# EAGLE design usbswitch (EAGLE 7.6.0)
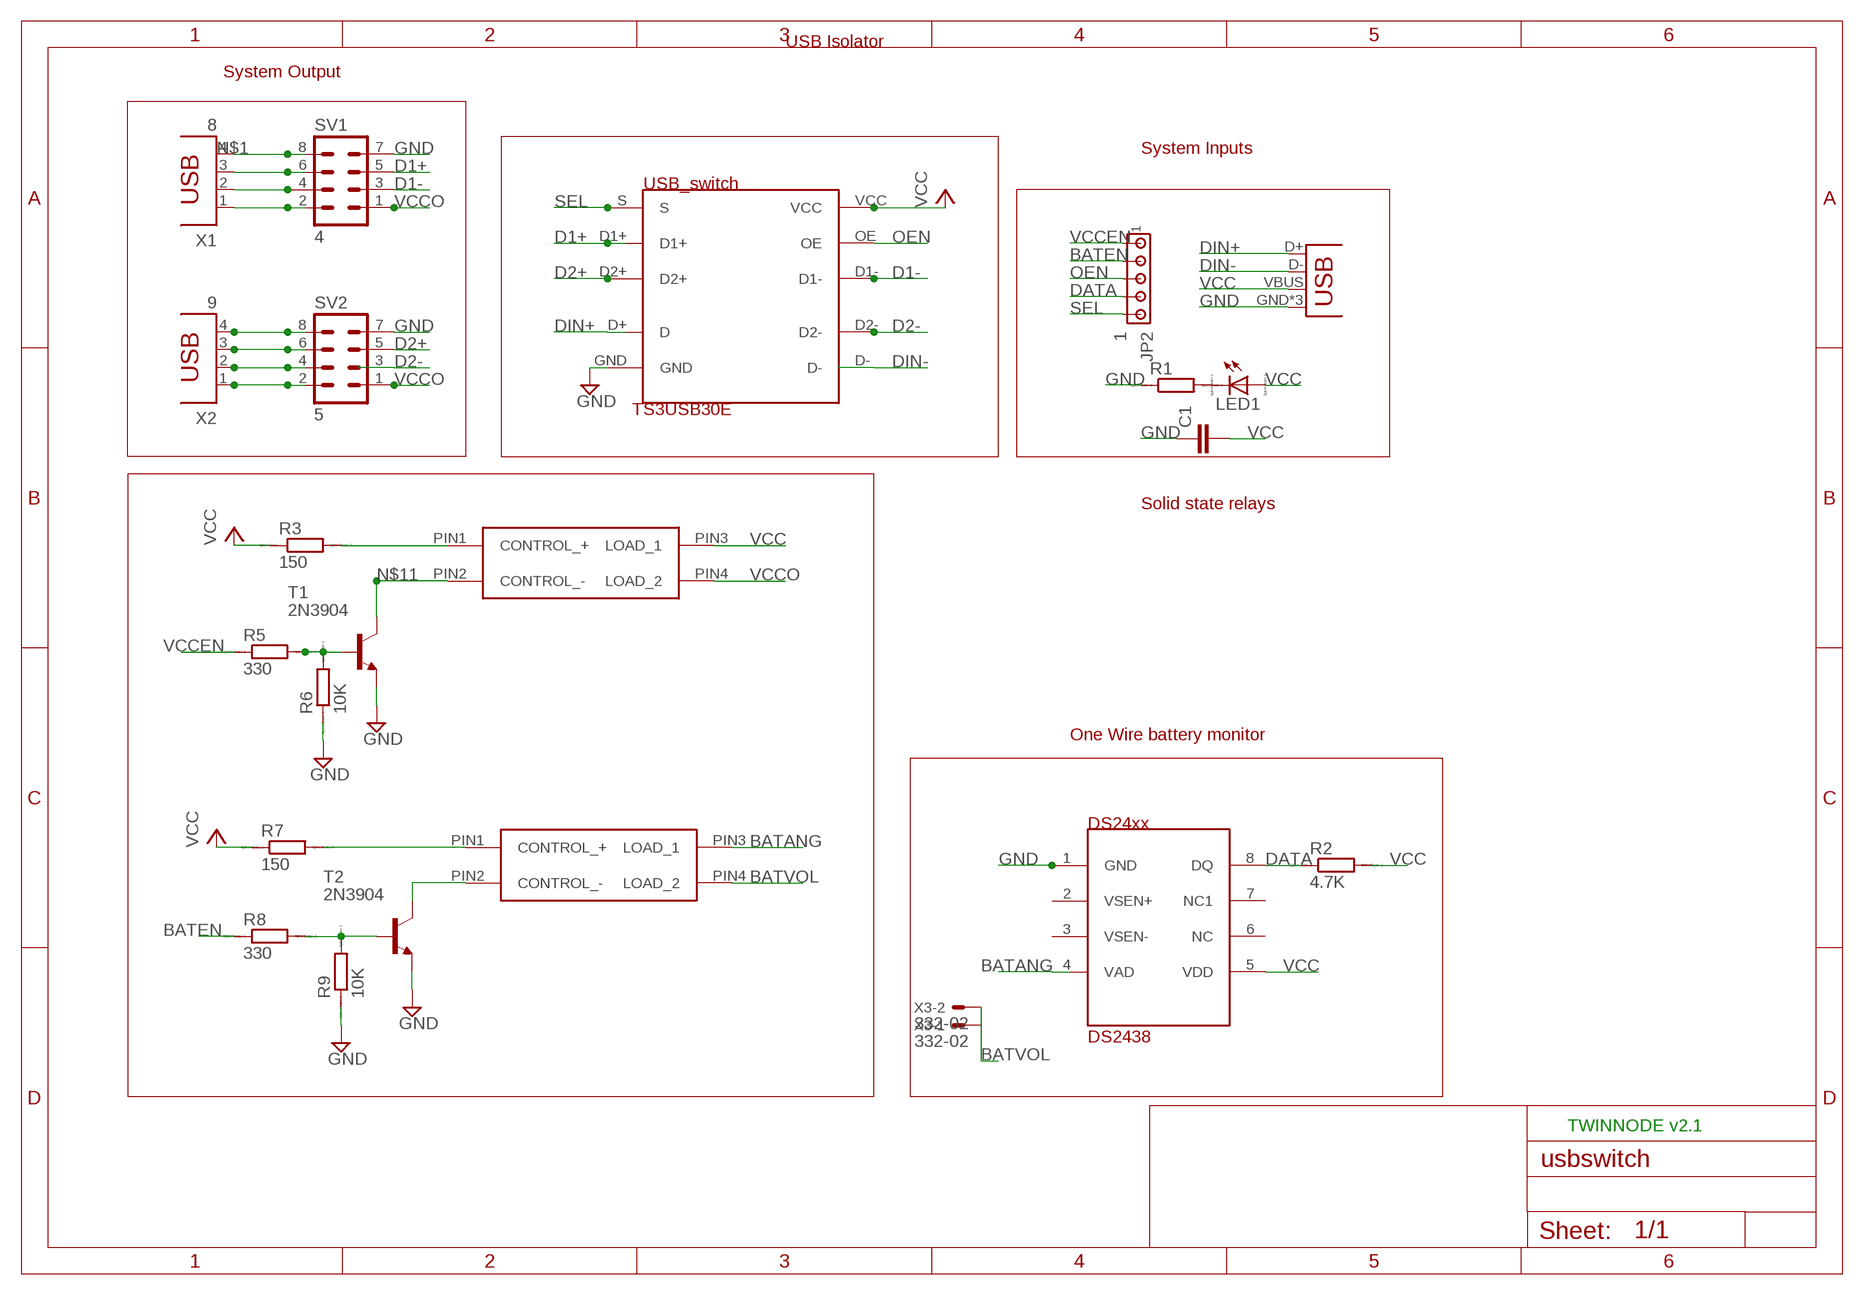
[diagram p0: schematic, sheet 1]

## Parts
C1  C2.5/6  [C2.5-6]
JP1  USB-MICROB  [USB-MICROB]
JP2  1  MTA05-100  [10X05MTA]
LED1  LED_ELD260  [LED_LD260]
R1  RR3216  [R3216]
R2  4.7K  RR3216  [R3216]
R3  150  RR3216  [R3216]
R5  330  RR3216  [R3216]
R6  10K  RR3216  [R3216]
R7  150  RR3216  [R3216]
R8  330  RR3216  [R3216]
R9  10K  RR3216  [R3216]
SV1  4  MA04-2  [MA04-2]
SV2  5  MA04-2  [MA04-2]
T1  2N3904  [TO92]
T2  2N3904  [TO92]
U$1  USB_SWITCH  [PDSO-G10]
U$2  DS2438  [DS243PKG]
U$3  OPTO-RELAY-CPC1017N  [SOP-4]
U$4  OPTO-RELAY-CPC1017N  [SOP-4]
X1  8  PN87520  [PN87520]
X2  9  PN87520  [PN87520]
X3  332-02  [332-02]

## Nets
BATANG: U$2.4(VAD) U$3.PIN3(LOAD_1)
BATEN: JP2.2 R8.1
BATVOL: U$3.PIN4(LOAD_2) X3.1 X3.2
D1+: SV1.5 U$1.D1+
D1-: SV1.3 U$1.D1-
D2+: SV2.5 U$1.D2+
D2-: SV2.3 U$1.D2-
DATA: JP2.4 R2.1 U$2.8(DQ)
DIN+: JP1.D+ U$1.D+(D)
DIN-: JP1.D- U$1.D-
GND: C1.1 JP1.GND JP1.MT1(GND) JP1.MT2(GND) R1.1 R6.1 R9.1 SV1.7 SV2.7 T1.3(E) T2.3(E) U$1.GND U$2.1(GND)
N$1: SV1.8 X1.4
N$2: SV1.6 X1.3
N$3: SV1.4 X1.2
N$4: LED1.K(C) R1.2
N$5: SV2.8 X2.4
N$6: SV2.6 X2.3
N$7: SV2.4 X2.2
N$10: R5.2 R6.2 T1.2(B)
N$11: T1.1(C) U$4.PIN2(CONTROL_-)
N$12: R3.2 U$4.PIN1(CONTROL_+)
N$14: R8.2 R9.2 T2.2(B)
N$16: T2.1(C) U$3.PIN2(CONTROL_-)
N$18: R7.2 U$3.PIN1(CONTROL_+)
N$50: SV1.2 X1.1
N$51: SV2.2 X2.1
OEN: JP2.3 U$1.OE
SEL: JP2.5 U$1.S
VCC: C1.2 JP1.VBUS LED1.A R2.2 R3.1 R7.1 U$1.VCC U$2.5(VDD) U$4.PIN3(LOAD_1)
VCCEN: JP2.1 R5.1
VCCO: SV1.1 SV2.1 U$4.PIN4(LOAD_2)
Unconnected: U$2.2(VSEN+) U$2.3(VSEN-) U$2.6(NC) U$2.7(NC1)

## Notes on the sheet
- USB Isolator
- System Output
- System Inputs
- Solid state relays
- One Wire battery monitor
- TWINNODE v2.1

## Library data of the parts
C1 = capacitor-wima:C: CAPACITOR naming: grid - package width
JP1 = Feesta-parts:USB: USB Connectors USB-B-PTH is fully proven SKU : PRT-00139/CONN-08278 USB-miniB is fully proven SKU : PRT-00587 USB-A-PCB is untested. USB-A-H is throughly reviewed, but untested. Spark Fun Electronics SKU : PRT-00437 USB-B-SMT is throughly reviewed, but untested. Needs silkscreen touching up. USB-A-S has not been used/tested USB-MB-H has not been used/tested USB-MICROB has been used. CONN-09505; PROD_ID: CONN-09505
JP2 = con-amp:MTA05-100: AMP connector
LED1 = eagle-ltspice:LED_E: LED Source: http://www.osram.convergy.de Source: www.luxeon.com Source: www.kingbright.com; SPICEMODEL: NONE; SPICEPREFIX: D; SPICETYPE: diode
R1-R3 R5-R9 = eagle-ltspice:R: RESISTOR, European symbol; SPICEMODEL: NONE; SPICEPREFIX: R
SV1 SV2 = con-lstb:MA04-2: PIN HEADER; OC_FARNELL: unknown; OC_NEWARK: unknown
T1 T2 = transistor:2N3904: NPN TRANSISTOR
U$1 = myusbswitch:USB_SWITCH: Usb_switch
U$2 = DS24xx:DS2438
U$3 U$4 = Feesta-parts:OPTO-RELAY-CPC1017N
X1 X2 = con-berg:PN87520: BERG USB connector; OC_FARNELL: unknown; OC_NEWARK: unknown
X3 = con-garry:332-02: 2 Pin - 2mm Dual Row Source: www.mpe-connector.de / garry_shortform_2012.pdf

## Board
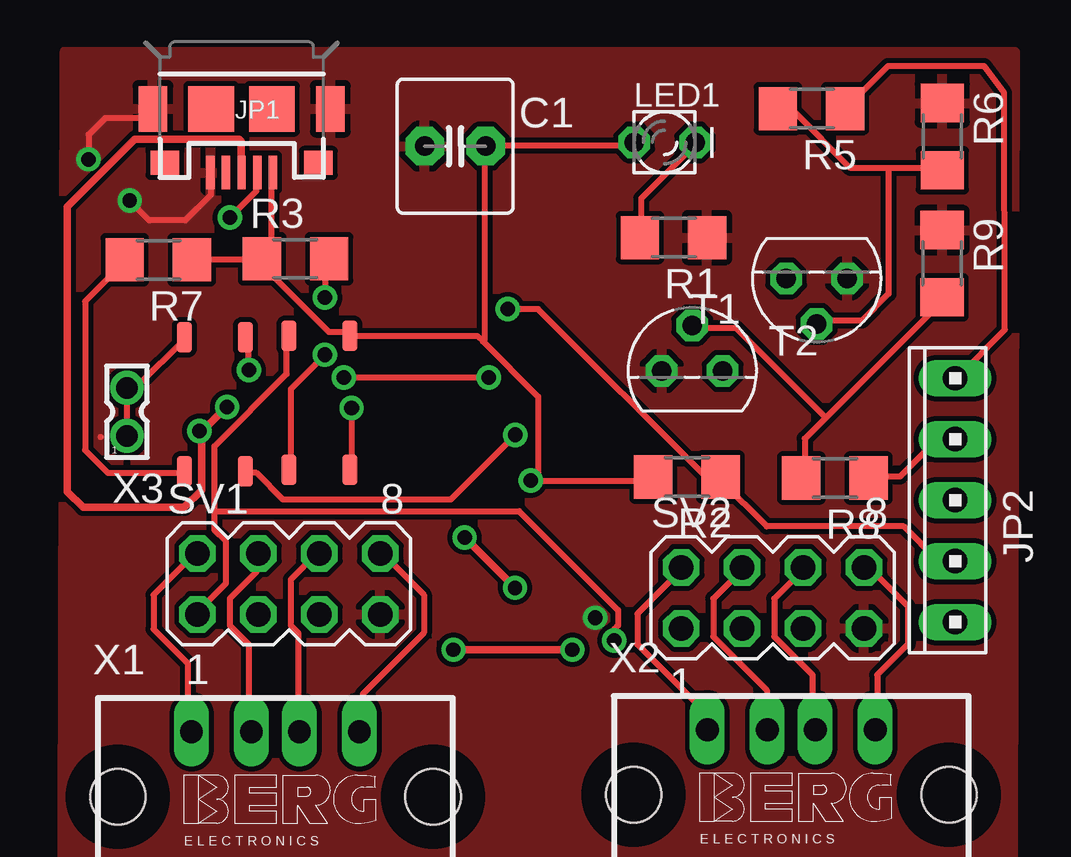
[diagram p1: board, top side]
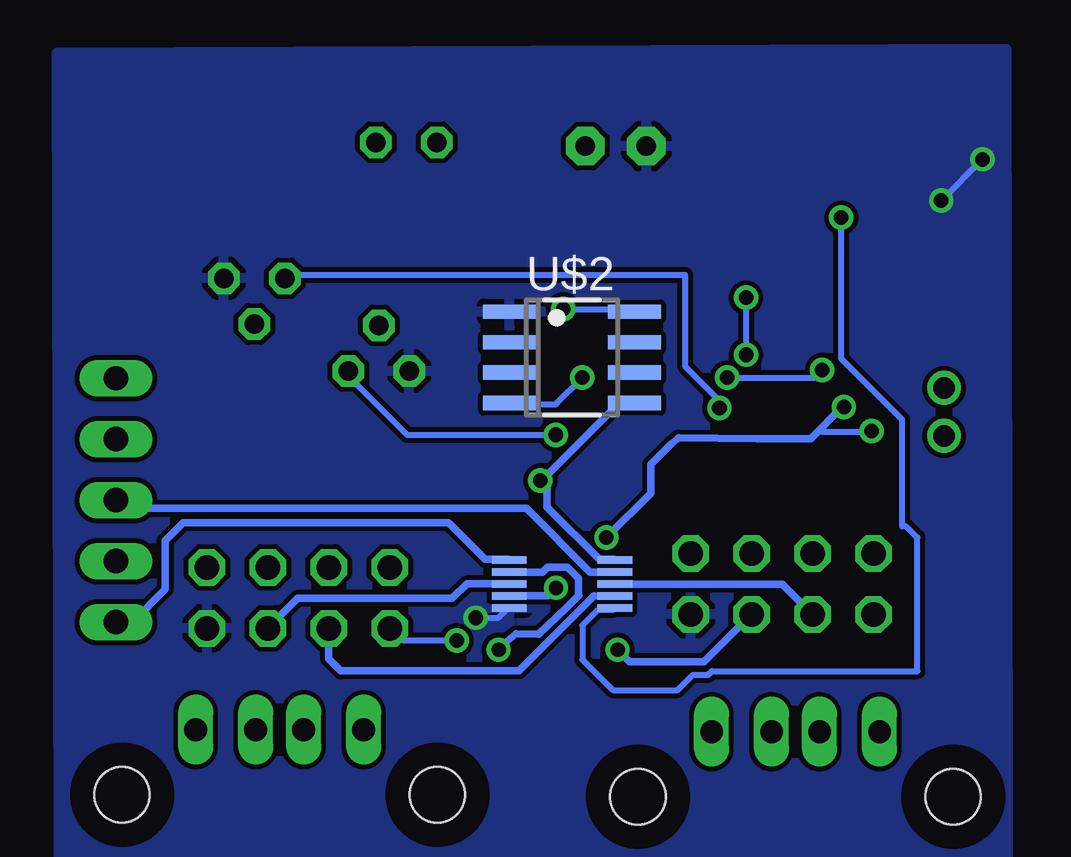
[diagram p2: board, bottom side, seen from below]

No outline drawn. Coordinates in mm, seen from the top.
Copper layers (1*16): Top 0.035mm / dielectric 1.5mm / Bottom 0.035mm
Design rules "default": minimum track width 10mil, minimum drill 24mil, track to track 8mil, track to pad 8mil, pad to pad 8mil, via to via 8mil, smd to smd 8mil, copper to edge 40mil, drill to drill 8mil, minimum pad ring 10mil, minimum via ring 8mil, stop-mask expansion 4mil, vias tented up to drill 0mil, thermal gap 10mil

### Footprints (pad centres in the part's own frame; a part is rotated, then mirrored left to right if it is on the bottom)
C2.5-6 = drill 0.813 pad 1.6 octagon: 1 -1.27,0; 2 1.27,0
USB-MICROB = smd 0.35 x 1.4: D+ 0,2.65; D- -0.65,2.65; GND 1.3,2.65; ID 0.65,2.65; VBUS -1.3,2.65 | smd 1.2 x 1.9: MT1 -3.7,0; MT2 3.7,0 | smd 1.9 x 1.9: P$1 -1.27,0; P$2 1.27,0 | smd 1.2 x 1: P$3 -3.2,2.25; P$4 3.2,2.25
10X05MTA = drill 1.016 long: 1 5.08,0; 2 2.54,0; 3 0,0; 4 -2.54,0; 5 -5.08,0
LED_LD260 = drill 0.813 octagon: A -1.27,0; K 1.27,0
R3216 = smd 1.6 x 1.8: 1 -1.4,0; 2 1.4,0
MA04-2 = drill 1.016 octagon: 1 -3.81,-1.27; 2 -3.81,1.27; 3 -1.27,-1.27; 4 -1.27,1.27; 5 1.27,-1.27; 6 1.27,1.27; 7 3.81,-1.27; 8 3.81,1.27
TO92 = drill 0.813 octagon: 1 1.27,0; 2 0,1.905; 3 -1.27,0
PDSO-G10 = smd 1.448 x 0.305: D1+ 0,1.5; D1- 4.4,1; D2+ 0,1; D2- 4.4,0.5; D+ 0,0.5; D- 4.4,0; GND 0,0; OE 4.4,1.5; S 0,2; VCC 4.4,2
DS243PKG = smd 2.2 x 0.6 bottom: 1 7.68,3.175; 2 7.68,1.905; 3 7.68,0.635; 4 7.68,-0.635; 5 2.48,-0.635; 6 2.48,0.635; 7 2.48,1.905; 8 2.48,3.175
SOP-4 = smd 0.635 x 1.27: PIN1 -1.27,-2.794; PIN2 1.27,-2.794; PIN3 1.27,2.794; PIN4 -1.27,2.794
PN87520 = drill 0.95 long: 1 -3.5,2.71; 2 -1,2.71; 3 1,2.71; 4 3.5,2.71 | hole 2.3: -6.57,0; 6.57,0
332-02 = drill 0.9 pad 1.27: 1 0,-1; 2 0,1

### Placement (x,y rotation side)
C1  13.84,48.7 0 top
JP1  4.94,50.25 180 top
JP2  34.69,33.95 90 top
LED1  22.57,48.86 0 top
R1  22.95,44.89 180 top
R2  [R3216]  23.5,34.91 180 top
R3  7.19,44.01 0 top
R5  28.7,50.26 180 top
R6  34.15,49.1 270 top
R7  1.47,43.96 180 top
R8  29.67,34.87 180 top
R9  34.14,43.8 270 top
SV1  6.91,30.46 0 top
SV2  27.08,29.88 0 top
T1  28.91,43.19 180 top
T2  23.72,39.33 0 top
U$1  18.28,29.45 0 bottom
U$2  10.59,38.62 0 top
U$3  3.82,37.94 0 top
U$4  8.18,38.01 0 top
X1  6.35,21.59 0 top
X2  27.85,21.67 0 top
X3  0.16,37.63 0 top

### Tracks (layer width: path | path; a pad name or v marks a point on that pad's centre or on a via)
BATANG  (via drill 0.61)
  Top 0.254: v5.24,39.37 5.24,40.64 U$3.PIN3 | v15.24,39.05 v9.21,39.05
  Bottom 0.254: v5.24,39.37 5.56,39.05 v9.21,39.05 | v15.24,39.05 16.35,37.94 18.26,37.94 U$2.4
BATEN
  Top 0.254: R8.1 31.11,34.92 32.38,34.92 33.81,36.35 34.61,36.35 JP2.2
BATVOL
  Top 0.254: U$3.PIN4 2.54,40.64 0.64,38.73 0.32,38.73 X3.2 0.16,38.58 0.16,36.67 X3.1
D1+  (via drill 0.6)
  Top 0.305: v13.77,27.71 v18.73,27.71
  Bottom 0.305: SV1.5 10.16,27.21 13.27,27.21 v13.77,27.71 | 18.19,30.94 18.29,30.96 U$1.D1+ 16.89,30.95 16.69,31.16 15.86,31.16 15.39,30.69 15.39,29.99 15.38,29.98 15.92,29.45 17.06,28.36 18.01,28.38 18.73,27.78 v18.73,27.71
D1-
  Bottom 0.305: SV1.3 6.91,30.45 U$1.D1-
D2+
  Bottom 0.305: U$1.D2+ 18.29,30.46 20.05,30.46 20.66,29.85 27.11,29.85 SV2.5
D2-
  Bottom 0.305: U$1.D2- 14.76,29.96 17.88,26.85 25.31,26.84 25.81,27.33 SV2.3
DATA  (via drill 0.61)
  Top 0.254: JP2.4 34.61,31.43 33.97,31.43 32.54,32.86 26.83,32.86 24.92,34.77 R2.1 24.77,34.92 24.29,34.92 17.3,41.91 v16.03,41.91
  Bottom 0.254: v16.03,41.91 13.18,41.91 U$2.8
DIN+  (via drill 0.6, 0.61)
  Top 0.254: v3.17,36.83 3.27,36.79
  Top 0.305: v16.34,30.29 v14.24,32.39 | JP1.D+ 4.92,47.62 4.92,48.9 4.83,48.99 0.49,48.99 -2.33,46.17 -2.33,34.31 -1.66,33.65 2.55,33.65 3.27,34.36 3.27,36.79 4.3,37.82 4.4,37.82 | v3.17,36.83 3.16,36.85
  Bottom 0.254: 11.28,36.53 11.53,36.29 | v3.17,36.83 3.2,36.8 5.26,36.8 5.34,36.89
  Bottom 0.305: U$1.D+ 18.27,29.96 16.82,29.96 16.81,29.97 16.68,29.97 16.36,30.29 v16.34,30.29 | v14.24,32.39 14.22,32.39 12.38,34.23 12.38,34.67 12.38,35.44 11.53,36.29 11.22,36.55 7.96,36.51 7.93,36.52 7.29,36.52 5.71,36.52 5.34,36.89 4.79,37.44 4.41,37.81
DIN-  (via drill 0.61)
  Top 0.254: v4.45,45.72 5.56,46.83 5.56,47.47 JP1.D-
  Bottom 0.254: v4.45,45.72 4.45,39.85 1.91,37.31 1.91,32.86 1.75,32.86 1.27,32.38 1.27,26.83 9.84,26.83 10,26.67 10.64,26.67 11.27,26.04 13.97,26.04 15.24,27.3 15.24,28.73 14.61,29.37 13.97,29.37 U$1.D-
GND  (via drill 0.6, 0.61)
  Top 0.254: -0.91,36.58 -0.95,36.58 | JP1.MT2 0.86,49.87 -0.75,49.87 -1.44,49.18 v-1.44,48.15 | JP1.GND 3.65,47.59 3.65,46.66 2.59,45.6 1.09,45.6 v0.28,46.42 v0.28,46.43
  Bottom 0.254: v19.68,29.05 18.73,29.05 18.41,29.37 U$1.GND | v-1.44,48.15 v0.28,46.43
  pour Bottom: -2.45,52.75 37.16,52.59 37.07,11.26 -2.54,11.43
  pour Top: -2.43,52.66 37.18,52.63 37.07,11.4 -2.54,11.43
N$1
  Top 0.254: X1.4 10,24.45 10,25.88 12.54,28.42 12.54,30 10.79,31.75 SV1.8
N$2
  Top 0.254: X1.3 7.3,24.45 7.3,28.42 6.99,28.73 6.99,30.64 8.1,31.75 SV1.6
N$3
  Top 0.254: X1.2 5.24,24.45 5.24,27.94 4.45,28.73 4.45,29.84 5.56,30.96 5.56,31.59 SV1.4
N$4
  Top 0.254: R1.2 21.59,44.93 21.59,46.51 23.81,48.74 LED1.K
N$5
  Top 0.254: X2.4 31.43,24.45 31.43,26.67 32.7,27.94 32.7,29.53 30.96,31.27 SV2.8
N$6
  Top 0.254: X2.3 28.73,24.45 28.73,26.67 27.15,28.26 27.15,29.84 28.42,31.11 SV2.6
N$7
  Top 0.254: X2.2 26.83,24.45 26.83,26.04 24.61,28.26 24.61,29.84 25.88,31.11 SV2.4
N$9  (via drill 0.6)
  other vias: 4.33,37.83
N$10
  Top 0.254: 31.91,47.78 34.13,47.78 R6.2 | 31.91,47.78 30.32,47.78 27.94,50.16 27.3,50.16 R5.2 | 31.91,47.78 31.91,42.55 30.8,41.43 29.05,41.43 T1.2
N$11  (via drill 0.61)
  Top 0.254: v9.53,37.78 9.53,35.24 U$4.PIN2
  Bottom 0.254: v9.53,37.78 9.53,38.1 10.95,39.53 10.95,43.34 27.62,43.34 T1.1
N$12  (via drill 0.61)
  Top 0.254: v8.41,40.01 6.99,38.58 6.99,35.24 U$4.PIN1 | v8.41,42.39 8.41,43.81 8.57,43.97 R3.2
  Bottom 0.254: v8.41,42.39 v8.41,40.01
N$14
  Top 0.254: 29.29,37.39 34.29,42.39 R9.2 | 29.29,37.39 28.42,36.51 28.42,34.92 R8.2 | 29.29,37.39 25.56,41.12 23.81,41.12 T2.2
N$16  (via drill 0.61)
  Top 0.254: v16.35,36.67 13.65,33.97 6.67,33.97 5.56,35.08 5.24,35.08 U$3.PIN2
  Bottom 0.254: v16.35,36.67 22.54,36.67 25.08,39.21 T2.1
N$18
  Top 0.254: U$3.PIN1 2.54,35.08 -0.64,35.08 -1.59,36.04 -1.59,42.23 0,43.81 R7.2
N$50
  Top 0.254: X1.1 2.7,24.45 2.7,27.15 1.27,28.57 1.27,30 3.02,31.75 SV1.2
N$51
  Top 0.254: X2.1 24.29,24.45 24.29,25.08 21.43,27.94 21.43,29.21 23.34,31.11 SV2.2
OEN
  Bottom 0.305: JP2.3 34.34,33.61 17.57,33.61 14.92,30.95 U$1.OE
SEL
  Bottom 0.305: U$1.S 18.31,31.48 19.29,31.48 20.82,33.01 31.87,33.01 32.63,32.25 32.63,30.23 33.99,28.87 JP2.5
VCC  (via drill 0.61)
  Top 0.254: LED1.A 21.27,48.74 15.24,48.74 C1.2 15.08,48.58 15.08,40.64 15,40.56 | 17.3,34.77 22.07,34.77 R2.2 | R3.1 5.87,43.97 5.87,43.66 8.57,40.96 9.37,40.96 U$4.PIN3 9.53,40.8 14.76,40.8 15,40.56 | JP1.VBUS 6.19,47.47 6.19,43.5 R3.1 | R7.1 3.02,43.97 5.71,43.97 R3.1 | 17.3,34.77 17.3,38.26 15,40.56 | 17.3,34.77 v16.99,34.77
  Bottom 0.254: 16.72,34.77 v16.99,34.77
  Bottom 0.305: U$1.VCC 13.91,31.48 14.53,31.48 16.72,33.66 16.72,34.77 16.72,34.99 13.72,37.99 U$2.5
VCCEN
  Top 0.254: R5.1 30.16,50.32 31.88,52.03 35.9,52.03 36.73,50.92 36.76,41.06 34.77,39.05 JP2.1
VCCO  (via drill 0.61)
  Top 0.254: 3.81,33.5 3.81,32.7 4.29,32.23 4.29,30.48 3.02,29.21 SV1.1 | 3.81,33.5 3.81,36.2 6.83,39.21 6.83,40.8 U$4.PIN4 | v20.48,28.1 20.48,28.57 20.64,28.73 20.64,29.37 16.51,33.5 3.81,33.5
  Bottom 0.254: v20.48,28.1 22.7,28.1 23.18,28.57 SV2.1